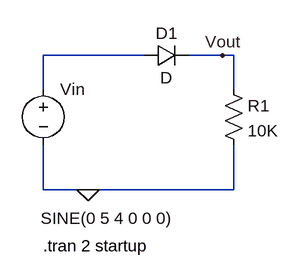
[diagram p0: schematic Exp 3 (Half-wave).asc]
Exp 3 (Half-wave).asc, the LTspice schematic file:
Version 4
SHEET 1 880 680
WIRE 128 -192 -16 -192
WIRE 240 -192 192 -192
WIRE 256 -192 240 -192
WIRE -16 -144 -16 -192
WIRE 256 -144 256 -192
WIRE -16 0 -16 -64
WIRE 48 0 -16 0
WIRE 256 0 256 -64
WIRE 256 0 48 0
FLAG 48 0 0
FLAG 240 -192 Vout
SYMBOL diode 128 -176 R270
WINDOW 0 32 32 VTop 2
WINDOW 3 0 32 VBottom 2
SYMATTR InstName D1
SYMBOL res 240 -160 R0
SYMATTR InstName R1
SYMATTR Value 10K
SYMBOL voltage -16 -160 R0
WINDOW 3 -4 201 Left 2
WINDOW 123 0 0 Left 0
WINDOW 39 0 0 Left 0
SYMATTR Value SINE(0 5 4 0 0 0)
SYMATTR InstName Vin
TEXT -16 80 Left 2 !.tran 2 startup

The netlist it stands for:
* Exp 3 (Half-wave).asc
D1 N001 Vout D
R1 Vout 0 10K
Vin N001 0 SINE(0 5 4 0 0 0)
.model D D
.lib standard.dio
.tran 2 startup
.backanno
.end